# Altium schematic sheet ZYNQ-Power.SchDoc
size A3; SheetNumber: 3; SheetTotal: 9; SPICEModelCacheBYAJFYWK: <root> / <DocumentId>BYAJFYWK</DocumentId> / <CacheFrame Number="0"> / <Model Name="emk063bbj474_plf" Kind="CKT"> / <Text>* EMK063BBJ474_PLF     SPICE MODEL  ( General Type ) / *-------------------------------------------------------------------------------------------------------- / * Model Generated by TAIYO YUDEN Corporation (http://www.ty-top.com) / * Version 1.0 / * TAIYO YUDEN Control No. 170613 / * Copyright(c) 2017 TAIYO YUDEN CO.,LTD. All Rights Reserved. / *-------------------------------------------------------------------------------------------------------- / * / * Products Name : Multilayer Ceramic Capacitors / * / * Characteristics : / *     Capacitance : 0.47 uF , Rated Voltage : 16V , TCC : X5R / *     Case Size : 0.6 x 0.3 / 0.024 x 0.012 [mm/inch] , Thickness : 0.3 / 0.012 [mm/inch] / *     (Conditions: Temperature = 25 degC , DC Bias Current/Voltage = 0A / 0V) / * / * Frequency Range : 40Hz - 3GHz / * / * External Node Assignments : / * / *  1  o---| |---o  2 / * / *-------------------------------------------------------------------------------------------------------- / .SubCkt EMK063BBJ474_PLF 1 2 / **************************** / C0 1 110 0.343u / Cm 1 101 0.070566u / C1 101 102 0.19677u / Rc1 101 102 5.4832k / C2 102 103 0.088709u / Rc2 102 103 328.07 / C3 103 110 0.045948u / Rc3 103 110 5.95 / C2m 1 301 0.10435u / C21 301 302 1.1799u / Rc21 301 302 9.4241k / C22 302 303 0.78774u / Rc22 302 303 13.724k / C23 303 304 0.3659u / Rc23 303 304 10.75k / C24 304 305 0.19785u / Rc24 304 305 937.28 / C25 305 306 0.79433u / Rc25 305 306 187.76 / C26 306 307 0.2114u / Rc26 306 307 57.148 / C27 307 308 0.12309u / Rc27 307 308 22.875 / C28 308 309 0.060909u / Rc28 308 309 28.453 / C29 309 110 2918.5p / Rc29 309 110 0.61373 / Rp0 1 110 212.765957446809Meg / L0 110 120 0.12773n / Lm 120 130 0.093632n / L1 120 121 0.017026n / RL1 121 130 0.51897 / L2 120 122 0.039017n / RL2 122 130 1.1018 / L3 120 123 0.19653n / RL3 123 130 98.604m / CR 120 124 0.08294u / LR 124 125 0.038088n / RR 125 130 0.10805 / CL 130 140 3.8165p / LL 130 140 0.069007n / RL 130 140 4.9149k / Rs 140 2 8.9319m / **************************** / .ends EMK063BBJ474_PLF</Text> / </Model> / </CacheFrame> / </root>
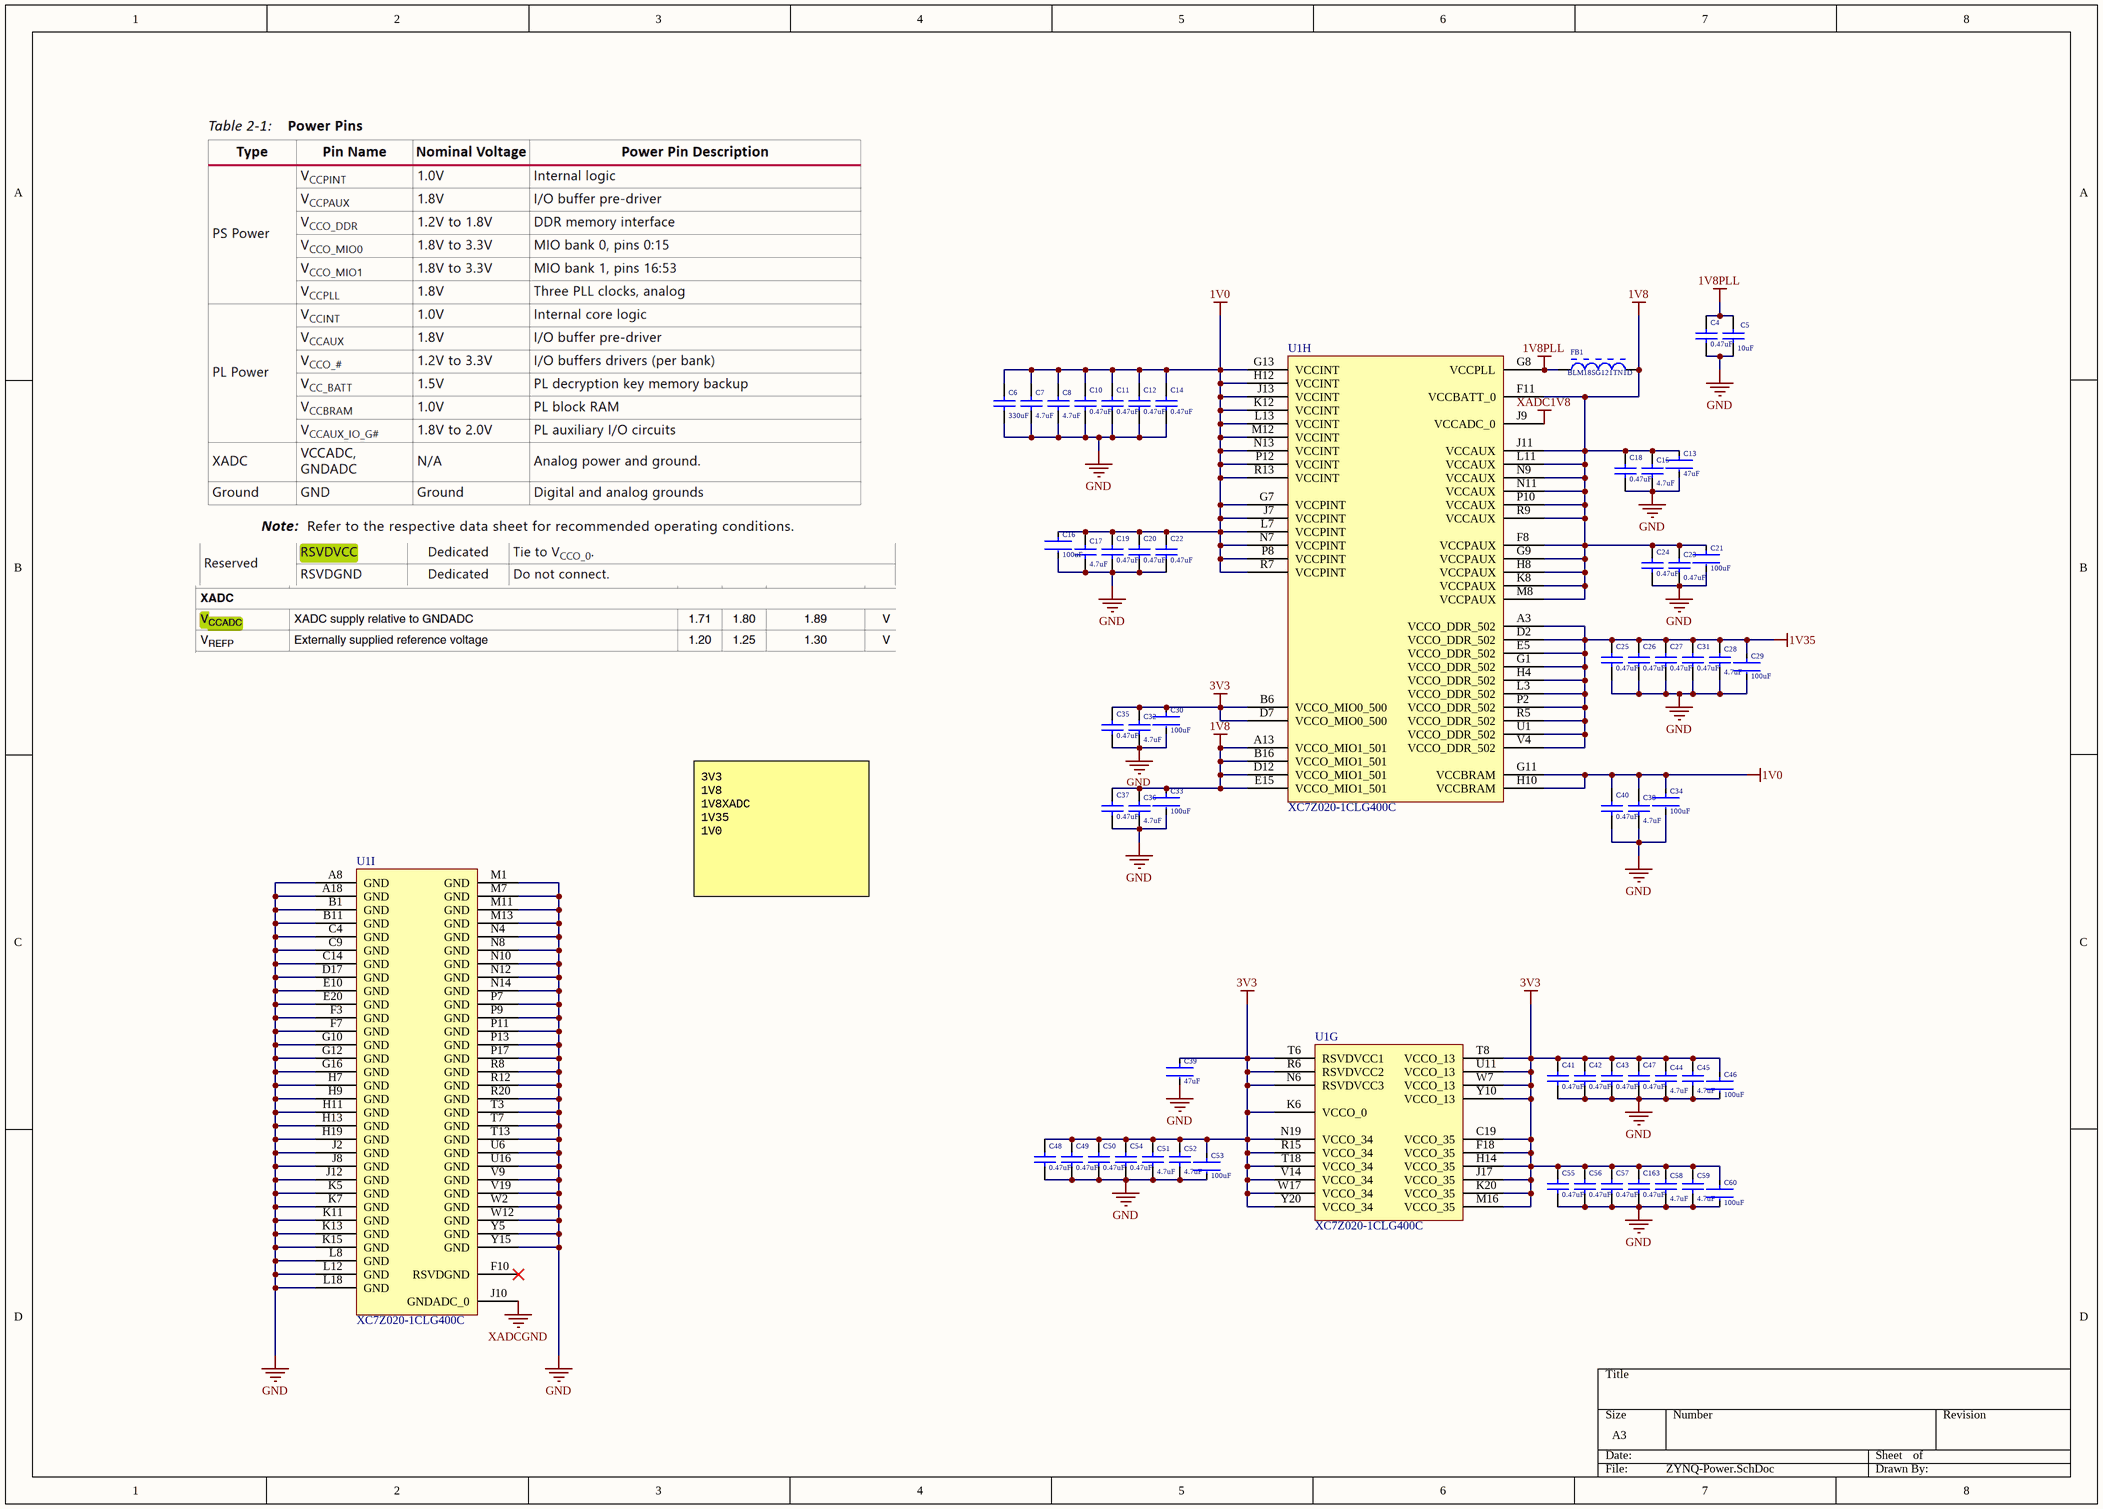
[diagram p0: ZYNQ-Power.SchDoc]

## Parts
C4  0.47uF  [FP-0201-L_0_6_0_09-W_0_3-IPC_A]
C5  10uF  [CAPC1608X90X35LL10T15]
C6  330uF  [CAPC3225X270X30LL30]
C7  4.7uF  [CAPC1005X55X25LL05T10]
C8  4.7uF  [CAPC1005X55X25LL05T10]
C10  0.47uF  [FP-0201-L_0_6_0_09-W_0_3-IPC_A]
C11  0.47uF  [FP-0201-L_0_6_0_09-W_0_3-IPC_A]
C12  0.47uF  [FP-0201-L_0_6_0_09-W_0_3-IPC_A]
C13  47uF  [FP-GCM31C-0_2-e0_3_0_8-IPC_C]
C14  0.47uF  [FP-0201-L_0_6_0_09-W_0_3-IPC_A]
C15  4.7uF  [CAPC1005X55X25LL05T10]
C16  100uF  [FP-GCM31C-0_2-e0_3_0_8-IPC_C]
C17  4.7uF  [CAPC1005X55X25LL05T10]
C18  0.47uF  [FP-0201-L_0_6_0_09-W_0_3-IPC_A]
C19  0.47uF  [FP-0201-L_0_6_0_09-W_0_3-IPC_A]
C20  0.47uF  [FP-0201-L_0_6_0_09-W_0_3-IPC_A]
C21  100uF  [FP-GCM31C-0_2-e0_3_0_8-IPC_C]
C22  0.47uF  [FP-0201-L_0_6_0_09-W_0_3-IPC_A]
C23  0.47uF  [CAPC1005X55X25LL05T10]
C24  0.47uF  [FP-0201-L_0_6_0_09-W_0_3-IPC_A]
C25  0.47uF  [FP-0201-L_0_6_0_09-W_0_3-IPC_A]
C26  0.47uF  [FP-0201-L_0_6_0_09-W_0_3-IPC_A]
C27  0.47uF  [FP-0201-L_0_6_0_09-W_0_3-IPC_A]
C28  4.7uF  [CAPC1005X55X25LL05T10]
C29  100uF  [FP-GCM31C-0_2-e0_3_0_8-IPC_C]
C30  100uF  [FP-GCM31C-0_2-e0_3_0_8-IPC_C]
C31  0.47uF  [FP-0201-L_0_6_0_09-W_0_3-IPC_A]
C32  4.7uF  [CAPC1005X55X25LL05T10]
C33  100uF  [FP-GCM31C-0_2-e0_3_0_8-IPC_C]
C34  100uF  [FP-GCM31C-0_2-e0_3_0_8-IPC_C]
C35  0.47uF  [FP-0201-L_0_6_0_09-W_0_3-IPC_A]
C36  4.7uF  [CAPC1005X55X25LL05T10]
C37  0.47uF  [FP-0201-L_0_6_0_09-W_0_3-IPC_A]
C38  4.7uF  [CAPC1005X55X25LL05T10]
C39  47uF  [FP-GCM31C-0_2-e0_3_0_8-IPC_C]
C40  0.47uF  [FP-0201-L_0_6_0_09-W_0_3-IPC_A]
C41  0.47uF  [FP-0201-L_0_6_0_09-W_0_3-IPC_A]
C42  0.47uF  [FP-0201-L_0_6_0_09-W_0_3-IPC_A]
C43  0.47uF  [FP-0201-L_0_6_0_09-W_0_3-IPC_A]
C44  4.7uF  [CAPC1005X55X25LL05T10]
C45  4.7uF  [CAPC1005X55X25LL05T10]
C46  100uF  [FP-GCM31C-0_2-e0_3_0_8-IPC_C]
C47  0.47uF  [FP-0201-L_0_6_0_09-W_0_3-IPC_A]
C48  0.47uF  [FP-0201-L_0_6_0_09-W_0_3-IPC_A]
C49  0.47uF  [FP-0201-L_0_6_0_09-W_0_3-IPC_A]
C50  0.47uF  [FP-0201-L_0_6_0_09-W_0_3-IPC_A]
C51  4.7uF  [CAPC1005X55X25LL05T10]
C52  4.7uF  [CAPC1005X55X25LL05T10]
C53  100uF  [FP-GCM31C-0_2-e0_3_0_8-IPC_C]
C54  0.47uF  [FP-0201-L_0_6_0_09-W_0_3-IPC_A]
C55  0.47uF  [FP-0201-L_0_6_0_09-W_0_3-IPC_A]
C56  0.47uF  [FP-0201-L_0_6_0_09-W_0_3-IPC_A]
C57  0.47uF  [FP-0201-L_0_6_0_09-W_0_3-IPC_A]
C58  4.7uF  [CAPC1005X55X25LL05T10]
C59  4.7uF  [CAPC1005X55X25LL05T10]
C60  100uF  [FP-GCM31C-0_2-e0_3_0_8-IPC_C]
C163  0.47uF  [FP-0201-L_0_6_0_09-W_0_3-IPC_A]
FB1  BLM18SG121TN1D  [MURA-BLM18SG-B40-CHIP-2_V6]
U1  XC7Z020-1CLG400C  [CLG400]  (parts G,H,I of 9)

## Nets
1V0: C6.2 C7.2 C8.2 C10.2 C11.2 C12.2 C14.2 C16.1 C17.2 C19.2 C20.2 C22.2 C34.1 C38.2 C40.2 U1.G7(VCCPINT) U1.G11(VCCBRAM) U1.G13(VCCINT) U1.H10(VCCBRAM) U1.H12(VCCINT) U1.J7(VCCPINT) U1.J13(VCCINT) U1.K12(VCCINT) U1.L7(VCCPINT) U1.L13(VCCINT) U1.M12(VCCINT) U1.N7(VCCPINT) U1.N13(VCCINT) U1.P8(VCCPINT) U1.P12(VCCINT) U1.R7(VCCPINT) U1.R13(VCCINT)
1V8: C13.1 C15.2 C18.2 C21.1 C23.2 C24.2 C33.1 C36.2 C37.2 FB1.2 U1.A13(VCCO_MIO1_501) U1.B16(VCCO_MIO1_501) U1.D12(VCCO_MIO1_501) U1.E15(VCCO_MIO1_501) U1.F8(VCCPAUX) U1.F11(VCCBATT_0) U1.G9(VCCPAUX) U1.H8(VCCPAUX) U1.J11(VCCAUX) U1.K8(VCCPAUX) U1.L11(VCCAUX) U1.M8(VCCPAUX) U1.N9(VCCAUX) U1.N11(VCCAUX) U1.P10(VCCAUX) U1.R9(VCCAUX)
1V8PLL: C4.2 C5.2 FB1.1 U1.G8(VCCPLL)
1V35: C25.2 C26.2 C27.2 C28.2 C29.1 C31.2 U1.A3(VCCO_DDR_502) U1.D2(VCCO_DDR_502) U1.E5(VCCO_DDR_502) U1.G1(VCCO_DDR_502) U1.H4(VCCO_DDR_502) U1.L3(VCCO_DDR_502) U1.P2(VCCO_DDR_502) U1.R5(VCCO_DDR_502) U1.U1(VCCO_DDR_502) U1.V4(VCCO_DDR_502)
3V3: C30.1 C32.2 C35.2 C39.1 C41.2 C42.2 C43.2 C44.2 C45.2 C46.1 C47.2 C48.2 C49.2 C50.2 C51.2 C52.2 C53.1 C54.2 C55.2 C56.2 C57.2 C58.2 C59.2 C60.1 C163.2 U1.B6(VCCO_MIO0_500) U1.C19(VCCO_35) U1.D7(VCCO_MIO0_500) U1.F18(VCCO_35) U1.H14(VCCO_35) U1.J17(VCCO_35) U1.K6(VCCO_0) U1.K20(VCCO_35) U1.M16(VCCO_35) U1.N6(RSVDVCC3) U1.N19(VCCO_34) U1.R6(RSVDVCC2) U1.R15(VCCO_34) U1.T6(RSVDVCC1) U1.T8(VCCO_13) U1.T18(VCCO_34) U1.U11(VCCO_13) U1.V14(VCCO_34) U1.W7(VCCO_13) U1.W17(VCCO_34) U1.Y10(VCCO_13) U1.Y20(VCCO_34)
GND: C4.1 C5.1 C6.1 C7.1 C8.1 C10.1 C11.1 C12.1 C13.2 C14.1 C15.1 C16.2 C17.1 C18.1 C19.1 C20.1 C21.2 C22.1 C23.1 C24.1 C25.1 C26.1 C27.1 C28.1 C29.2 C30.2 C31.1 C32.1 C33.2 C34.2 C35.1 C36.1 C37.1 C38.1 C39.2 C40.1 C41.1 C42.1 C43.1 C44.1 C45.1 C46.2 C47.1 C48.1 C49.1 C50.1 C51.1 C52.1 C53.2 C54.1 C55.1 C56.1 C57.1 C58.1 C59.1 C60.2 C163.1 U1.A8(GND) U1.A18(GND) U1.B1(GND) U1.B11(GND) U1.C4(GND) U1.C9(GND) U1.C14(GND) U1.D17(GND) U1.E10(GND) U1.E20(GND) U1.F3(GND) U1.F7(GND) U1.G10(GND) U1.G12(GND) U1.G16(GND) U1.H7(GND) U1.H9(GND) U1.H11(GND) U1.H13(GND) U1.H19(GND) U1.J2(GND) U1.J8(GND) U1.J12(GND) U1.K5(GND) U1.K7(GND) U1.K11(GND) U1.K13(GND) U1.K15(GND) U1.L8(GND) U1.L12(GND) U1.L18(GND) U1.M1(GND) U1.M7(GND) U1.M11(GND) U1.M13(GND) U1.N4(GND) U1.N8(GND) U1.N10(GND) U1.N12(GND) U1.N14(GND) U1.P7(GND) U1.P9(GND) U1.P11(GND) U1.P13(GND) U1.P17(GND) U1.R8(GND) U1.R12(GND) U1.R20(GND) U1.T3(GND) U1.T7(GND) U1.T13(GND) U1.U6(GND) U1.U16(GND) U1.V9(GND) U1.V19(GND) U1.W2(GND) U1.W12(GND) U1.Y5(GND) U1.Y15(GND)
XADC1V8: U1.J9(VCCADC_0)
XADCGND: U1.J10(GNDADC_0)

Not connected (* = marked no-connect by the designer): U1 F10(RSVDGND)*

## Notes on the sheet
- 3V3
  1V8
  1V8XADC
  1V35
  1V0

## Library data of the parts
C4 C10-C12 C14 C18-C20 C22 C24-C27 C31 C35 C37 C40-C43 C47-C50 C54-C57 C163 = CMP-00086-2: Multilayer Ceramic Capacitor 0.47uF 16V 10% 0201 Paper T/R; Value: 470nF; Max Operating Temperature: -55°C; RoHS Compliant: Yes; Height: 390um; Voltage Rating (DC): 16V; Min Operating Temperature: -55°C; Case/Package: 0201; Voltage Rating: 16V; Tolerance: 10%; Material: Ceramic
C5 = CMP-2006-02787-1: GRM188R60G106ME47D Checked Multilayer Ceramic Capacitor, 10 uF, 4 V, ± 20%, X5R, 0603 [1608 Metric] Ceramic Capacitors 0.1; Manufacturer: Murata; Part Number: GRM188R60G106ME47D
C6 = CMP-1662-00021-1: GRM32ER60G337ME05L Checked / Multilayer Ceramic Capacitor, 330 uF, 4 V, ± 20%, X5R, 1210 [3225 Metric] Ceramic Capacitors 1.11; Current Rating: 3 A; Colour: Black; Gender: Male; Contact Plating: Gold; PackageDescription: 2-Pin Surface Mount Device, Body 3.2 x 2.5 mm; Package Quantity: 100; Height: 8.13 mm; Pins: 40; Mount: Through Hole; ComponentLink1URL: http://www.murata.com/; RoHSCompliant: True; Packaging: Tray; ComponentLink2URL: https://datasheet.ciiva.com/3776/2741grm32er71e226ke1523-3776996.pdf; Width: 2.34 mm; Radiation Hardening: No; Lead Pitch: 2.54 mm; Min Operating Temperature: -65degC; Contact Finish: Gold; REACH SVHC: Unknown; Max Operating Temperature: 105degC; DatasheetVersion: Aug-14; Length: 101.19 mm; Contact Material: Bronze; ComponentLink2Description: Datasheet; ComponentLink1Description: Manufacturer URL; PackageReference: 1210
C7 C8 C15 C17 C28 C32 C36 C38 C44 C45 C51 C52 C58 C59 = CMP-2008-04639-1: GRM155R61E475ME15D / Ceramic Capacitor, Multilayer, Ceramic, 25V, 20% +Tol, 20% -Tol, X5R, 15% TC, 4.7uF, Surface Mount, 0402 Capacitors 0.1615; Part Number: GRM155R71H104KE14D; Manufacturer: Murata
C13 C39 = CMP-00080-1: GRM31CR60J476KE19L Checked / Multilayer Ceramic Capacitor, 47 uF, 6.3 V, ± 10%, X5R, 1206 [3216 Metric] Ceramic Capacitors 0.42; RoHS Compliant: Yes
C16 C21 C29 C30 C33 C34 C46 C53 C60 = CMP-00080-1: GRM31CR61A107MEA8K Checked / SMD Multilayer Ceramic Capacitor, 100 µF, 10 V, 1206 [3216 Metric], ± 20%, X5R, GRM Series Ceramic Capacitors 0.58; RoHS Compliant: Yes
C23 = CMP-2008-04639-1: GRM155R61H474KE11D / Multilayer Ceramic Capacitor, 0.47 uF, 50 V, ± 10%, X5R, 0402 [1005 Metric] Ceramic Capacitors 0.1; Part Number: GRM155R71H104KE14D; Manufacturer: Murata
FB1 = CMP-0686-00602-3: Chip Ferrite Bead for Power Lines (Low DC Resistance Type), 120 Ohm, 3000 mA, -55 to 125 degC, 1.6 x 0.8 x 0.65 mm SMD, Tape and Reel; Manufacturer: Murata; Impedance (at 100 MHz): 120 Ohm +/- 25%; Rated Current: 3000 mA; DC Resistance: 0.025 Ohm Max.; ComponentLink3Description: Package Specification; PackageReference: BLM18_H650-2; DatasheetVersion: 08/2013; Packing: Tape and Reel; PartNumber: BLM18SG121TN1D; PackageDescription: 2-Pin Chip, Body 1.6 x 0.8 mm; ComponentLink2Description: Datasheet; ComponentLink3URL: http://www.murata.com/products/catalog/pdf/c31e.pdf; ComponentLink1URL: http://www.murata.com/; Operating Temperature Range: -55 to 125 degC; Mounting Technology: Surface Mount; ComponentLink2URL: http://www.murata.com/products/catalog/pdf/c31e.pdf; ComponentLink1Description: Manufacturer URL
U1 = CMP-0363-00002-3: 667 MHz Zynq™-7000 AP SoC, 130 PS I/O, 125 FPGA I/O, 400-Ball BGA, Speed Grade 1, Commercial Grade, Pb-Free; Flip Flops: 106400; Speed Grade: -1; LUTs: 53200; Extensible Block RAM (# 36Kb Blocks): 560 KB (140); PackageVersion: Rev 1.1, 09/2012; ComponentLink1Description: Datasheet; ComponentLink2Description: Package Specification; ComponentLink6Description: PCB and Layout Guide; PackageDescription: Wire-Bond Chip-Scale BGA, Body 17 x 17 mm, 0.8 mm Pitch; RoHS: Pb-Free; DatasheetVersion: v1.2; Mounting Technology: Surface Mount; ComponentLink5Description: Packaging and Pinout; ComponentLink5URL: http://www.xilinx.com/support/documentation/user_guides/ug865-Zynq-7000-Pkg-Pinout.pdf; ComponentLink6URL: http://www.xilinx.com/support/documentation/user_guides/ug483_7Series_PCB.pdf; Generic Part Number: XC7Z020; ComponentLink3Description: DC and AC Switching Characteristics; ComponentLink2URL: http://www.xilinx.com/support/documentation/user_guides/ug865-Zynq-7000-Pkg-Pinout.pdf; ComponentLink4Description: Package File; ComponentLink1URL: http://www.xilinx.com/support/documentation/data_sheets/ds190-Zynq-7000-Overview.pdf; PackageReference: CLG400; ComponentLink3URL: http://www.xilinx.com/support/documentation/data_sheets/ds187-XC7Z010-XC7Z020-Data-Sheet.pdf; PartNumber: XC7Z020-1CLG400C; ComponentLink4URL: http://www.xilinx.com/support/packagefiles/z7packages/xc7z020clg400pkg.txt; Code_JEDEC: MO-275-MMAA-1